# Altium schematic sheet 7f - CAN.SchDoc
size A4
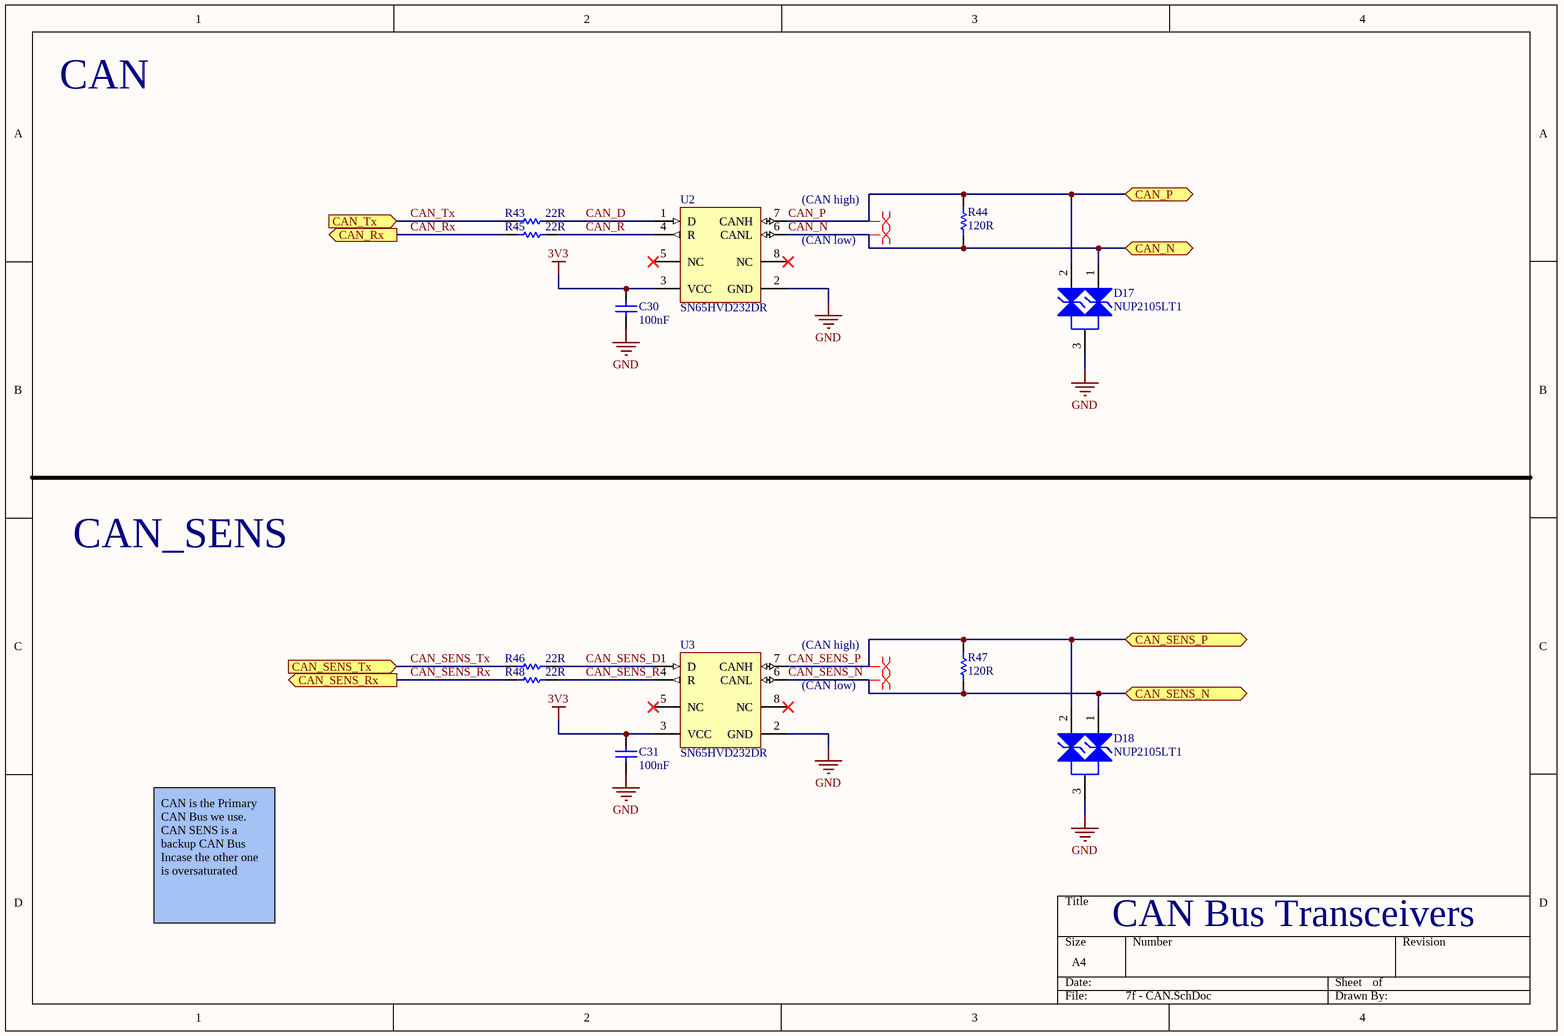
[diagram p0: 7f - CAN.SchDoc]

## Parts
C30  value 100nF  [1608[0603]]  (hidden comment: Cap)
C31  value 100nF  [1608[0603]]  (hidden comment: Cap)
D17  NUP2105LT1  [ONSC-SOT-23-3-318-08_V]
D18  NUP2105LT1  [ONSC-SOT-23-3-318-08_V]
R43  value 22R  [1608[0603]]  (hidden comment: Res1)
R44  value 120R  [1608[0603]]  (hidden comment: Res1)
R45  value 22R  [1608[0603]]  (hidden comment: Res1)
R46  value 22R  [1608[0603]]  (hidden comment: Res1)
R47  value 120R  [1608[0603]]  (hidden comment: Res1)
R48  value 22R  [1608[0603]]  (hidden comment: Res1)
U2  SN65HVD232DR  [D0008A_M]
U3  SN65HVD232DR  [D0008A_M]

## Ports
CAN_N (bidir), CAN_P (bidir), CAN_Rx (out), CAN_SENS_N (bidir), CAN_SENS_P (bidir), CAN_SENS_Rx (out), CAN_SENS_Tx (in), CAN_Tx (in)

## Nets
3V3: C30.2 C31.2 U2.3(VCC) U3.3(VCC)
GND: C30.1 C31.1 D17.3(K) D18.3(K) U2.2(GND) U3.2(GND)
CAN_D: R43.2 U2.1(D)
CAN_N: D17.1(K) R44.1 U2.6(CANL) ; port CAN_N
CAN_P: D17.2(K) R44.2 U2.7(CANH) ; port CAN_P
CAN_R: R45.2 U2.4(R)
CAN_Rx: R45.1 ; port CAN_Rx
CAN_SENS_D: R46.2 U3.1(D)
CAN_SENS_N: D18.1(K) R47.1 U3.6(CANL) ; port CAN_SENS_N
CAN_SENS_P: D18.2(K) R47.2 U3.7(CANH) ; port CAN_SENS_P
CAN_SENS_R: R48.2 U3.4(R)
CAN_SENS_Rx: R48.1 ; port CAN_SENS_Rx
CAN_SENS_Tx: R46.1 ; port CAN_SENS_Tx
CAN_Tx: R43.1 ; port CAN_Tx

Not connected (* = marked no-connect by the designer): U2 5(NC)* 8(NC)*; U3 5(NC)* 8(NC)*

## Layout directives
differential pair: CAN_N, CAN_P, CAN_SENS_N, CAN_SENS_P

## Notes on the sheet
- CAN
- (near U2) (CAN high)
- (near U2) (CAN low)
- CAN_SENS
- (near U3) (CAN high)
- (near U3) (CAN low)
- CAN is the Primary CAN Bus we use. CAN SENS is a backup CAN Bus Incase the other one is oversaturated
- CAN Bus Transceivers

## Library data of the parts
C30 C31 = Cap: Capacitor; Published: 8-Jun-2000; LatestRevisionDate: 17-Jul-2002; LatestRevisionNote: Re-released for DXP Platform.; PackageReference: RAD-0.3; Publisher: Altium Limited; PackageDescription: Radial Cap, Thru-Hole; 2 Leads; 0.3 in Pin Spacing
D17 D18 = CMP-1063-00165-1: Dual Line CAN Bus Protector, 3-Pin SOT-23, Tape and Reel; Manufacturer: On Semiconductor; PPK Max (W): 350; IR Max (uA): 0.1; Number of Lines: 2; V(BR) Min (V): 26.2; Direction: Bidirectional; C Max (pF): 30; PackageDescription: 3-Pin Small Outline Transistor, Body 2.92 x 1.3 mm, Pitch 0.95 mm; ComponentLink2URL: http://www.onsemi.cn/pub_link/Collateral/NUP2105L-D.PDF; ComponentLink3Description: Package Specification; ComponentLink2Description: Datasheet; ComponentLink1URL: http://www.onsemi.com/; Mounting Technology: Surface Mount; ComponentLink1Description: Manufacturer URL; Packing: Tape and Reel; PackageVersion: Rev. AP, 11/2009; PartNumber: NUP2105LT1; DatasheetVersion: Rev. 5; ComponentLink3URL: http://www.onsemi.cn/pub_link/Collateral/318-08.PDF; PackageReference: SOT-23-3-318-08
R43-R48 = Res1: Resistor; Published: 8-Jun-2000; LatestRevisionDate: 17-Jul-2002; LatestRevisionNote: Re-released for DXP Platform.; PackageReference: AXIAL-0.3; Publisher: Altium Limited; PackageDescription: Axial Device, Thru-Hole; 2 Leads; 0.3 in Pin Spacing
U2 U3 = CMP-0315-00075-2: 3.3 V Can Transceiver, 17 mA, -40 to 85 degC, 8-pin SOIC (D), Green (RoHS & no Sb/Br); Manufacturer: Texas Instruments; Supply Voltage(s)(V): 3.3; Receivers Per Package: 1; ICC(Max)(mA): 17; Rating: Catalog; Transient Pulse Protection(V): -25 to 25; Mounting Technology: Surface Mount; PartNumber: SN65HVD232DR; Code_JEDEC: MS-012AA; Eco-Plan: Green (RoHS & no Sb/Br); Isolated: No; SubFamily: CAN; Footprint: SN65HVD232; Drivers Per Package: 1; ComponentLink1URL: http://www.ti.com/general/docs/lit/getliterature.tsp?genericPartNumber=SN65HVD232&fileType=pdf; ComponentLink1Description: Datasheet; PackageDescription: 8-Pin Plastic Small Outline Integrated Circuit, 4.9 x 3.9 mm, Pitch 1.27 mm Pitch; PackageReference: D0008A; DatasheetVersion: SLOS346K; PackageVersion: revM, Jun-2011